# Altium schematic sheet BAT_VOLTAGE_SENS.SchDoc
size A4; SheetNumber: 4; SheetTotal: 7
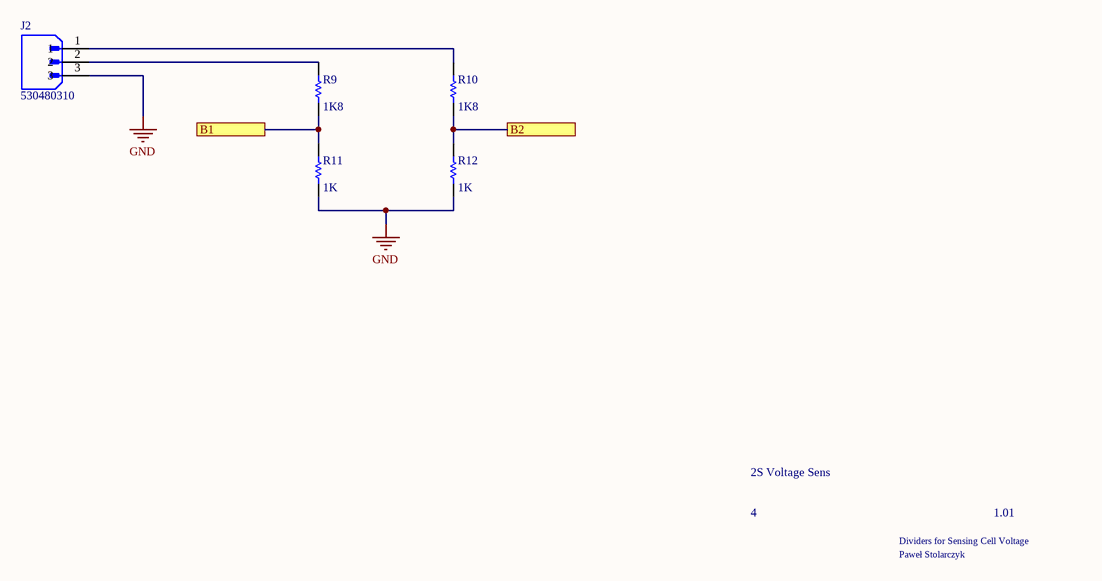
[diagram p0: BAT_VOLTAGE_SENS.SchDoc]

## Parts
J2  530480310  [MOLEX_530480310]
R9  value 1K8  [0402]  (hidden comment: Res1)
R10  value 1K8  [0402]  (hidden comment: Res1)
R11  value 1K  [0402]  (hidden comment: Res1)
R12  value 1K  [0402]  (hidden comment: Res1)

## Ports
B1 (see BMS_SLAVE[2C], MCU[3B]), B2 (see BMS_SLAVE[2C], MCU[3B])

## Nets
GND: J2.3 R11.1 R12.1
B1: R9.1 R11.2 ; port B1
B2: R10.1 R12.2 ; port B2
NetJ2_1: J2.1 R10.2
NetJ2_2: J2.2 R9.2

## Notes on the sheet
- 2S Voltage Sens
- 4
- Dividers for Sensing Cell Voltage
- 1.01
- Paweł Stolarczyk

## Library data of the parts
R9-R12 = Res1: Resistor; Published: 8-Jun-2000; LatestRevisionDate: 17-Jul-2002; LatestRevisionNote: Re-released for DXP Platform.; PackageReference: AXIAL-0.3; Publisher: Altium Limited; PackageDescription: Axial Device, Thru-Hole; 2 Leads; 0.3 in Pin Spacing
J2 = 530480310: Package: None; MP: 530480310; Value: *; Availability: Unavailable; Price: None